# EAGLE schematic board (EAGLE 7.6.0)

## Sheet 1 of 2
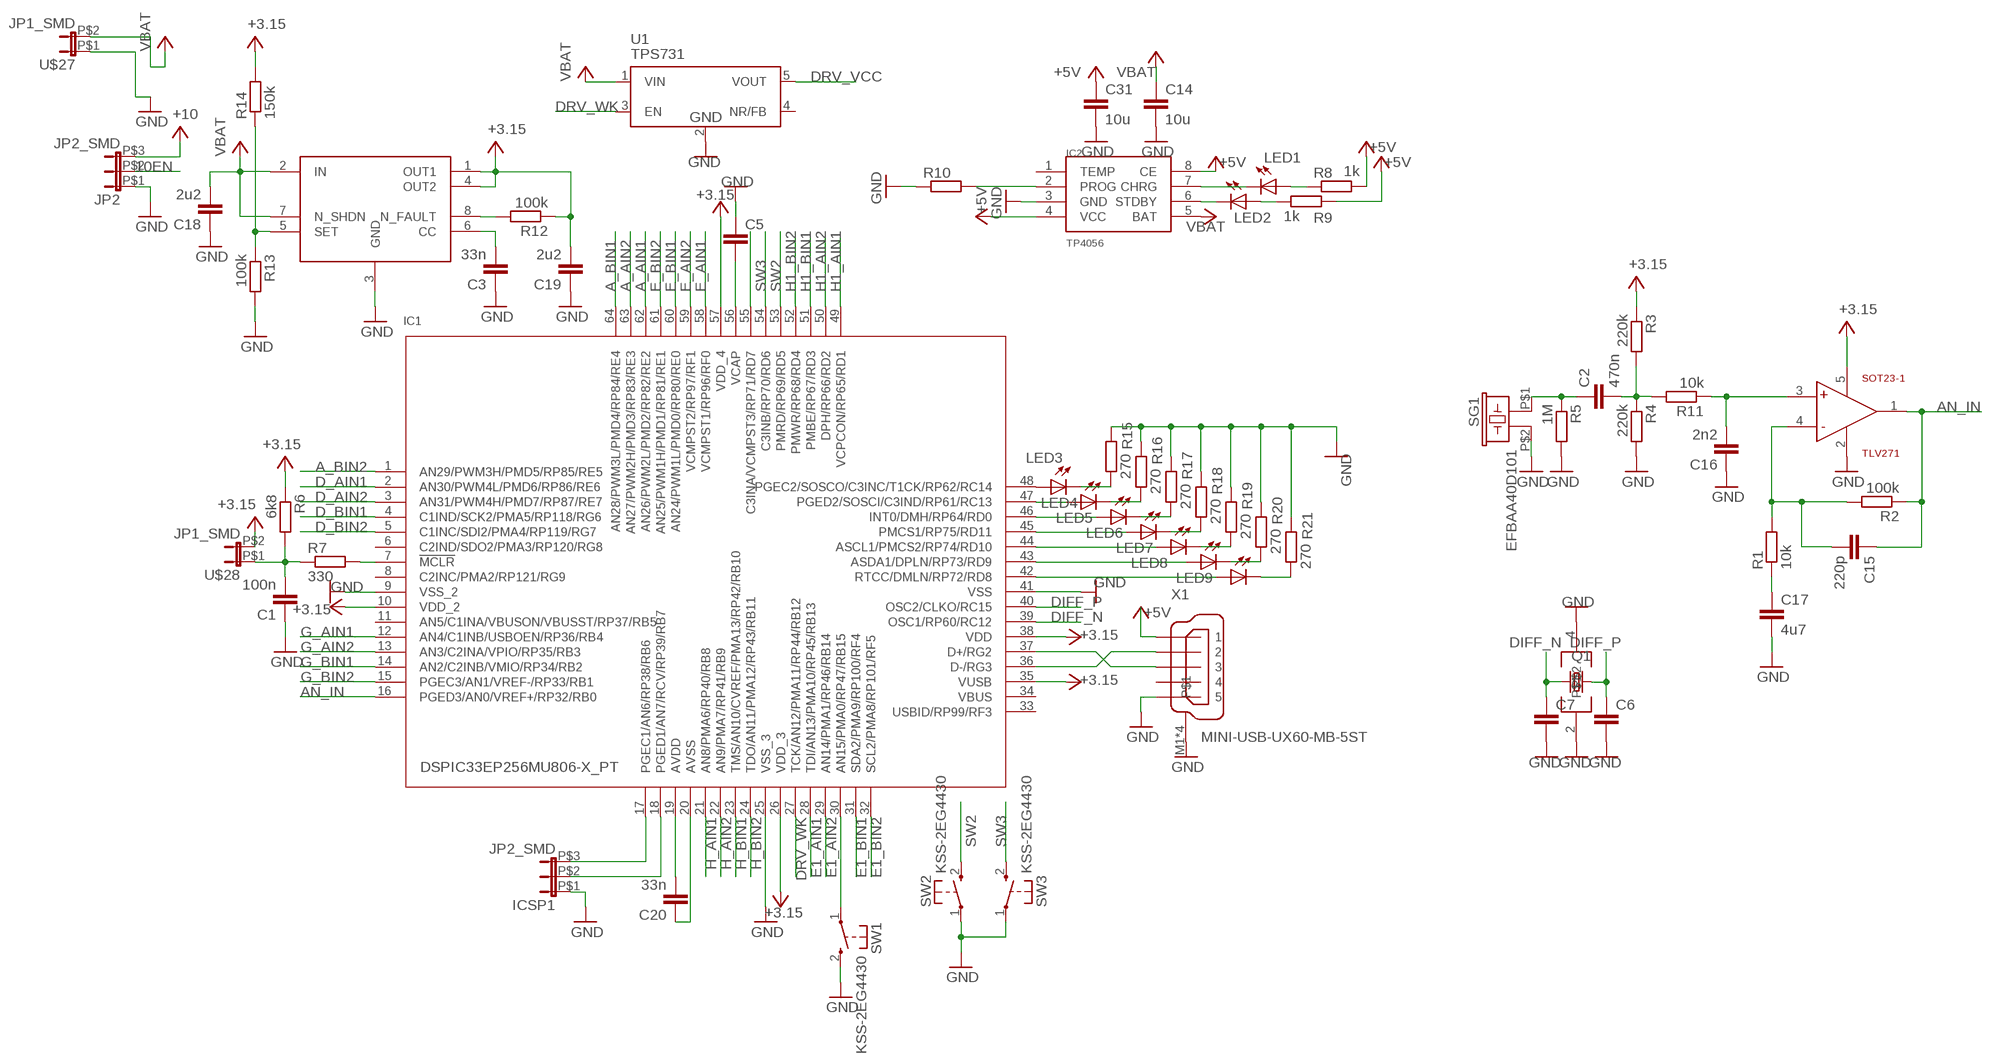
[diagram p0: schematic, sheet 1]

### Parts
C1  100n  CC0603  [C0603]
C2  470n  C  [C0805]
C3  33n  C  [C0805]
C5  CC1206  [C1206]
C6  C  [C0805]
C7  C  [C0805]
C14  10u  CC1206  [C1206]
C15  220p  C  [C0805]
C16  2n2  C  [C0805]
C17  4u7  CC1206  [C1206]
C18  2u2  C  [C0805]
C19  2u2  C  [C0805]
C20  33n  C  [C0805]
C31  10u  CC1206  [C1206]
IC1  DSPIC33EP256MU806-X_PT  [QFP64-10X10MC]
IC2  TP4056  [SOP-8]
ICSP1  JP2_SMD  [JP2_SMD]
JP2  JP2_SMD  [JP2_SMD]
LED1  LED_ESML0603  [LED_SML0603]
LED2  LED_ESML0603  [LED_SML0603]
LED3  LED_ESML0603  [LED_SML0603]
LED4  LED_ESML0603  [LED_SML0603]
LED5  LED_ESML0603  [LED_SML0603]
LED6  LED_ESML0603  [LED_SML0603]
LED7  LED_ESML0603  [LED_SML0603]
LED8  LED_ESML0603  [LED_SML0603]
LED9  LED_ESML0603  [LED_SML0603]
Q1  CRYSTALCTS406  [CTS406]
R1  10k  R  [R0805]
R2  100k  R  [R0805]
R3  220k  R  [R0805]
R4  220k  R  [R0805]
R5  1M  R  [R0805]
R6  6k8  RR0603  [R0603]
R7  330  RR0603  [R0603]
R8  1k  R  [R0805]
R9  1k  R  [R0805]
R10  R  [R0805]
R11  10k  R  [R0805]
R12  100k  R  [R0805]
R13  100k  R  [R0805]
R14  150k  R  [R0805]
R15  270  R  [R0805]
R16  270  R  [R0805]
R17  270  R  [R0805]
R18  270  R  [R0805]
R19  270  R  [R0805]
R20  270  R  [R0805]
R21  270  R  [R0805]
SG1  EFBAA40D101  [EFBAA40D101]
SOT23-1  TLV271  [SOT23-5]
SW1  KSS-2EG4430  [KSS-2EG4430]
SW2  KSS-2EG4430  [KSS-2EG4430]
SW3  KSS-2EG4430  [KSS-2EG4430]
U1  TPS731  [SOT25]
U$8  LP3982  [LP3982]
U$27  JP1_SMD  [JP1_SMD]
U$28  JP1_SMD  [JP1_SMD]
X1  MINI-USB-UX60-MB-5ST  [UX60-MB-5ST]

### Nets
10EN: IC1.55(C3INA/VCMPST3/RP71/RD7) JP2.P$2
+3.15: R6.1 U$28.P$2
+3.15V: C19.2 IC1.10(VDD_2) IC1.26(VDD_3) IC1.35(VUSB) IC1.38(VDD) IC1.57(VDD_4) R3.1 R12.1 R14.2 SOT23-1.5(VDD) U$8.1(OUT1) U$8.4(OUT2) ; supply symbol labelled +3.15 ; also sheet 2
+5V: C31.1 IC2.4(VCC) IC2.8(CE) R8.2 R9.2 X1.1
+10V: JP2.P$3 ; supply symbol labelled +10 ; also sheet 2
A_AIN1 [diffPair]: IC1.62(AN26/PWM2L/PMD2/RP82/RE2) ; also sheet 2
A_AIN2 [diffPair]: IC1.63(AN27/PWM2H/PMD3/RP83/RE3) ; also sheet 2
A_BIN1 [diffPair]: IC1.64(AN28/PWM3L/PMD4/RP84/RE4) ; also sheet 2
A_BIN2 [diffPair]: IC1.1(AN29/PWM3H/PMD5/RP85/RE5) ; also sheet 2
AN_IN: C15.1 IC1.16(PGED3/AN0/VREF+/RP32/RB0) R2.1 SOT23-1.1(OUT)
D_AIN1: IC1.2(AN30/PWM4L/PMD6/RP86/RE6) ; also sheet 2
D_AIN2: IC1.3(AN31/PWM4H/PMD7/RP87/RE7) ; also sheet 2
D_BIN1: IC1.4(C1IND/SCK2/PMA5/RP118/RG6) ; also sheet 2
D_BIN2: IC1.5(C1INC/SDI2/PMA4/RP119/RG7) ; also sheet 2
DIFF_N: C7.1 IC1.39(OSC1/RP60/RC12) Q1.3
DIFF_NS: IC1.36(D-/RG3) X1.2
DIFF_P: C6.1 IC1.40(OSC2/CLKO/RC15) Q1.1
DIFF_PD: IC1.37(D+/RG2) X1.3
DRV_VCC: U1.5(VOUT) ; also sheet 2
DRV_WK: IC1.27(TCK/AN12/PMA11/RP44/RB12) U1.3(EN)
E1_AIN1: IC1.28(TDI/AN13/PMA10/RP45/RB13) ; also sheet 2
E1_AIN2: IC1.29(AN14/PMA1/RP46/RB14) ; also sheet 2
E1_BIN1: IC1.31(SDA2/PMA9/RP100/RF4) ; also sheet 2
E1_BIN2: IC1.32(SCL2/PMA8/RP101/RF5) ; also sheet 2
E_AIN1: IC1.58(VCMPST1/RP96/RF0) ; also sheet 2
E_AIN2: IC1.59(VCMPST2/RP97/RF1) ; also sheet 2
E_BIN1: IC1.60(AN24/PWM1L/PMD0/RP80/RE0) ; also sheet 2
E_BIN2: IC1.61(AN25/PWM1H/PMD1/RP81/RE1) ; also sheet 2
FGH [diffPair]: IC1.17(PGEC1/AN6/RP38/RB6) ICSP1.P$3
G_AIN1: IC1.12(AN4/C1INB/USBOEN/RP36/RB4) ; also sheet 2
G_AIN2: IC1.13(AN3/C2INA/VPIO/RP35/RB3) ; also sheet 2
G_BIN1: IC1.14(AN2/C2INB/VMIO/RP34/RB2) ; also sheet 2
G_BIN2: IC1.15(PGEC3/AN1/VREF-/RP33/RB1) ; also sheet 2
GFD [diffPair]: IC1.18(PGED1/AN7/RCV/RP39/RB7) ICSP1.P$2
GND: C1.1 C3.1 C5.1 C6.2 C7.2 C14.2 C16.1 C17.2 C18.1 C19.1 C31.2 IC1.9(VSS_2) IC1.25(VSS_3) IC1.41(VSS) IC2.3(GND) ICSP1.P$1 JP2.P$1 Q1.2 Q1.4 R4.2 R5.2 R10.1 R13.2 R15.2 R16.2 R17.2 R18.2 R19.2 R20.2 R21.2 SG1.P$2 SOT23-1.2(GND) SW1.2(S) SW2.1(P) SW3.1(P) U1.2(GND) U$8.3(GND) U$27.P$1 X1.5 X1.M1 X1.M2 X1.M3 X1.M4 ; also sheet 2
H1_AIN1: IC1.49(VCPCON/RP65/RD1) ; also sheet 2
H1_AIN2: IC1.50(DPH/RP66/RD2) ; also sheet 2
H1_BIN1: IC1.51(PMBE/RP67/RD3) ; also sheet 2
H1_BIN2: IC1.52(PMWR/RP68/RD4) ; also sheet 2
H_AIN1: IC1.21(AN8/PMA6/RP40/RB8) ; also sheet 2
H_AIN2: IC1.22(AN9/PMA7/RP41/RB9) ; also sheet 2
H_BIN1: IC1.23(TMS/AN10/CVREF/PMA13/RP42/RB10) ; also sheet 2
H_BIN2: IC1.24(TDO/AN11/PMA12/RP43/RB11) ; also sheet 2
N$3: C20.2 IC1.19(AVDD)
N$4: C20.1 IC1.20(AVSS)
N$5: IC1.7(!MCLR) R7.2
N$6: C5.2 IC1.56(VCAP)
N$11: IC1.48(PGEC2/SOSCO/C3INC/T1CK/RP62/RC14) LED3.A
N$12: C15.2 R1.2 R2.2 SOT23-1.4(IN-)
N$13: C17.1 R1.1
N$14: C2.2 R3.2 R4.1 R11.2
N$15: IC2.7(CHRG) LED1.C
N$16: C2.1 R5.1 SG1.P$1
N$21: IC2.6(STDBY) LED2.C
N$22: LED2.A R9.1
N$23: LED1.A R8.1
N$24: IC2.2(PROG) R10.2
N$25: C16.2 R11.1 SOT23-1.3(IN+)
N$26: R12.2 U$8.8(N_FAULT)
N$31: C3.2 U$8.6(CC)
N$32: IC1.47(PGED2/SOSCI/C3IND/RP61/RC13) LED4.A
N$33: R13.1 R14.1 U$8.5(SET)
N$34: IC1.46(INT0/DMH/RP64/RD0) LED5.A
N$42: IC1.45(PMCS1/RP75/RD11) LED6.A
N$43: IC1.44(ASCL1/PMCS2/RP74/RD10) LED7.A
N$44: IC1.43(ASDA1/DPLN/RP73/RD9) LED8.A
N$45: IC1.42(RTCC/DMLN/RP72/RD8) LED9.A
N$46: LED9.C R21.1
N$51: LED8.C R20.1
N$52: LED7.C R19.1
N$53: LED6.C R18.1
N$54: LED5.C R17.1
N$55: LED4.C R16.1
N$56: LED3.C R15.1
N$62: IC1.30(AN15/PMA0/RP47/RB15) SW1.1(P)
RST: C1.2 R6.2 R7.1 U$28.P$1
SW2: IC1.53(PMRD/RP69/RD5) SW2.2(S)
SW3: IC1.54(C3INB/RP70/RD6) SW3.2(S)
VBAT: C14.1 C18.2 IC2.5(BAT) U1.1(VIN) U$8.2(IN) U$8.7(N_SHDN) U$27.P$2 ; also sheet 2
Unconnected: IC1.6(C2IND/SDO2/PMA3/RP120/RG8) IC1.8(C2INC/PMA2/RP121/RG9) IC1.11(AN5/C1INA/VBUSON/VBUSST/RP37/RB5) IC1.33(USBID/RP99/RF3) IC2.1(TEMP) U1.4(NR/FB) X1.4

## Sheet 2 of 2
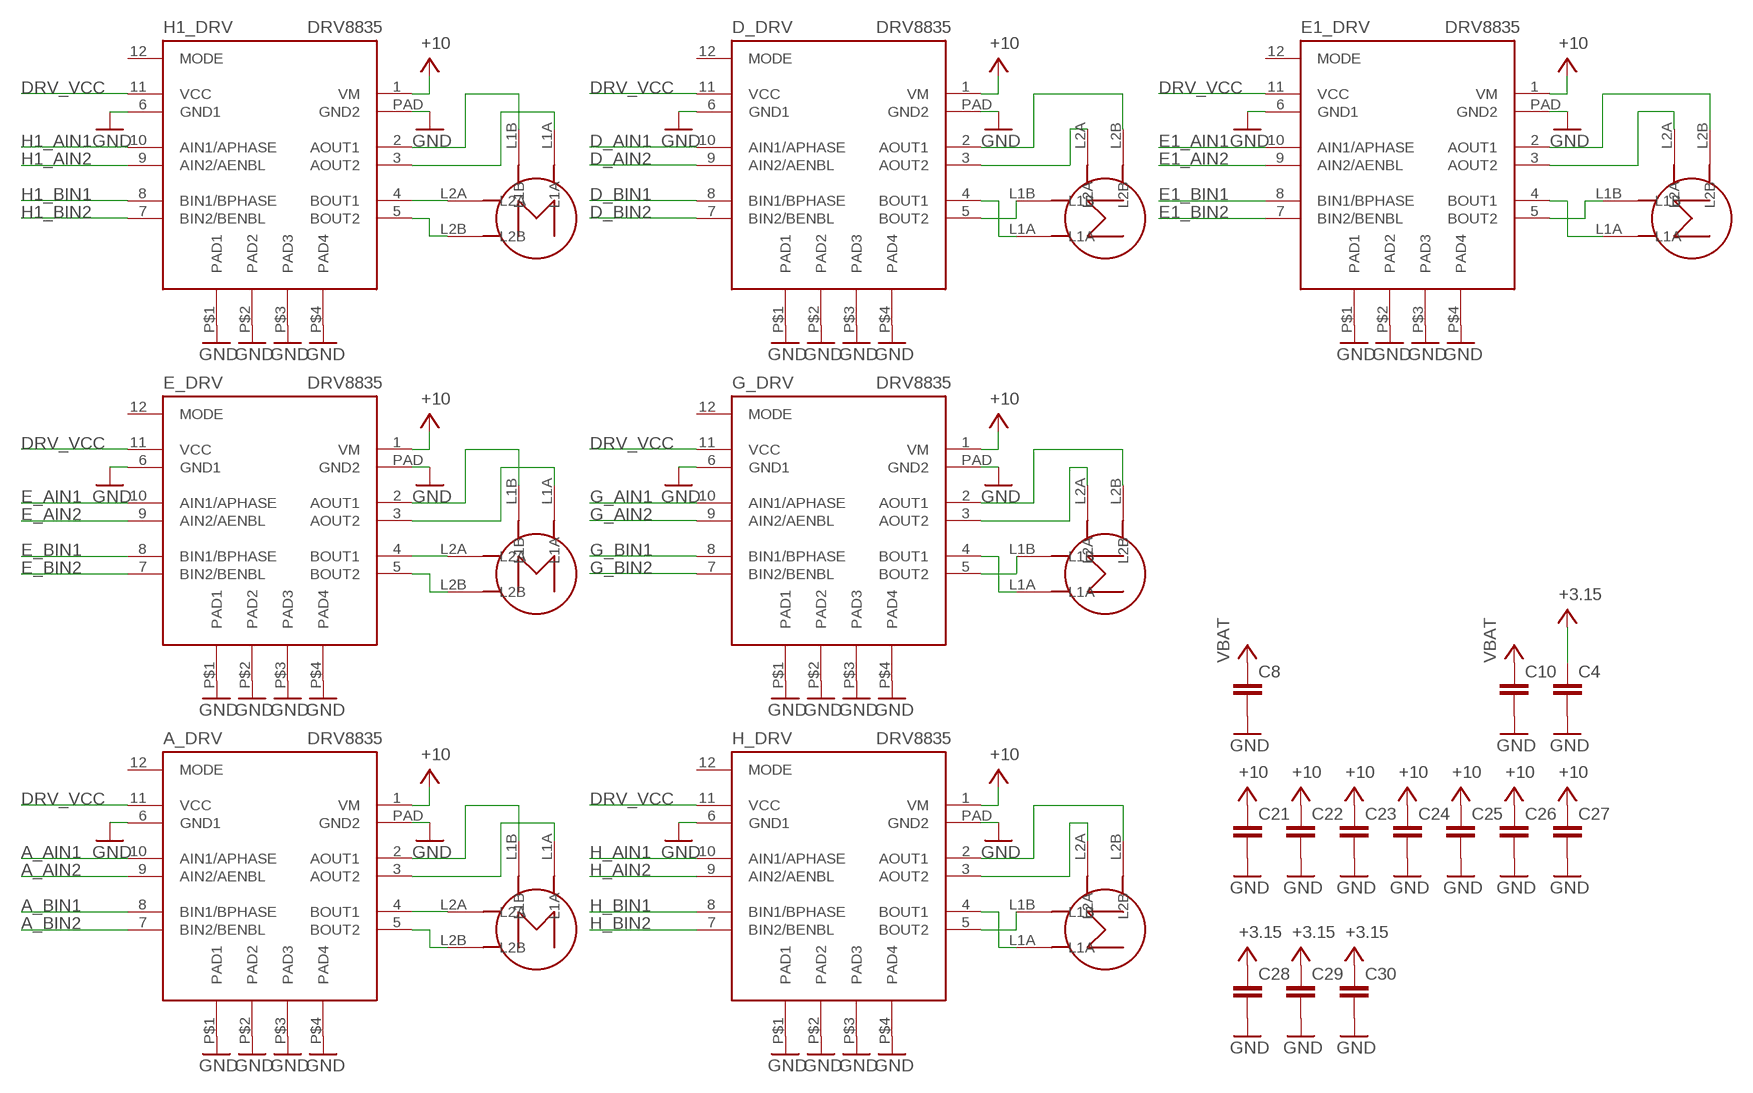
[diagram p1: schematic, sheet 2]

### Parts
A_DRV  DRV8835  [WSON_2X3]
C4  CC1206  [C1206]
C8  CC1206  [C1206]
C10  CC1206  [C1206]
C21  CC1206  [C1206]
C22  CC1206  [C1206]
C23  CC1206  [C1206]
C24  CC1206  [C1206]
C25  CC1206  [C1206]
C26  CC1206  [C1206]
C27  CC1206  [C1206]
C28  CC1206  [C1206]
C29  CC1206  [C1206]
C30  CC1206  [C1206]
D_DRV  DRV8835  [WSON_2X3]
E1_DRV  DRV8835  [WSON_2X3]
E_DRV  DRV8835  [WSON_2X3]
G_DRV  DRV8835  [WSON_2X3]
H1_DRV  DRV8835  [WSON_2X3]
H1šWF  H1  STEP_MOTOR  [STEP_MOTOR]
H_DRV  DRV8835  [WSON_2X3]
U$1  STEP_MOTOR_MIRROR  [STEP_MOTOR_MIRROR]
U$2  STEP_MOTOR_MIRROR  [STEP_MOTOR_MIRROR]
U$3  STEP_MOTOR_MIRROR  [STEP_MOTOR_MIRROR]
U$4  STEP_MOTOR  [STEP_MOTOR]
U$6  STEP_MOTOR  [STEP_MOTOR]
U$7  STEP_MOTOR_MIRROR  [STEP_MOTOR_MIRROR]

### Nets
+3.15V: C4.1 C28.1 C29.1 C30.1 ; supply symbol labelled +3.15 ; also sheet 1
+10V: A_DRV.1(VM) C21.1 C22.1 C23.1 C24.1 C25.1 C26.1 C27.1 D_DRV.1(VM) E1_DRV.1(VM) E_DRV.1(VM) G_DRV.1(VM) H1_DRV.1(VM) H_DRV.1(VM) ; supply symbol labelled +10 ; also sheet 1
A_AIN1 [diffPair]: A_DRV.10(AIN1/APHASE) ; also sheet 1
A_AIN2 [diffPair]: A_DRV.9(AIN2/AENBL) ; also sheet 1
A_BIN1 [diffPair]: A_DRV.8(BIN1/BPHASE) ; also sheet 1
A_BIN2 [diffPair]: A_DRV.7(BIN2/BENBL) ; also sheet 1
D_AIN1: D_DRV.10(AIN1/APHASE) ; also sheet 1
D_AIN2: D_DRV.9(AIN2/AENBL) ; also sheet 1
D_BIN1: D_DRV.8(BIN1/BPHASE) ; also sheet 1
D_BIN2: D_DRV.7(BIN2/BENBL) ; also sheet 1
DRV_VCC: A_DRV.11(VCC) D_DRV.11(VCC) E1_DRV.11(VCC) E_DRV.11(VCC) G_DRV.11(VCC) H1_DRV.11(VCC) H_DRV.11(VCC) ; also sheet 1
E1_AIN1: E1_DRV.10(AIN1/APHASE) ; also sheet 1
E1_AIN2: E1_DRV.9(AIN2/AENBL) ; also sheet 1
E1_BIN1: E1_DRV.8(BIN1/BPHASE) ; also sheet 1
E1_BIN2: E1_DRV.7(BIN2/BENBL) ; also sheet 1
E_AIN1: E_DRV.10(AIN1/APHASE) ; also sheet 1
E_AIN2: E_DRV.9(AIN2/AENBL) ; also sheet 1
E_BIN1: E_DRV.8(BIN1/BPHASE) ; also sheet 1
E_BIN2: E_DRV.7(BIN2/BENBL) ; also sheet 1
G_AIN1: G_DRV.10(AIN1/APHASE) ; also sheet 1
G_AIN2: G_DRV.9(AIN2/AENBL) ; also sheet 1
G_BIN1: G_DRV.8(BIN1/BPHASE) ; also sheet 1
G_BIN2: G_DRV.7(BIN2/BENBL) ; also sheet 1
GND: A_DRV.6(GND1) A_DRV.P$1(PAD1) A_DRV.P$2(PAD2) A_DRV.P$3(PAD3) A_DRV.P$4(PAD4) A_DRV.PAD(GND2) C4.2 C8.2 C10.2 C21.2 C22.2 C23.2 C24.2 C25.2 C26.2 C27.2 C28.2 C29.2 C30.2 D_DRV.6(GND1) D_DRV.P$1(PAD1) D_DRV.P$2(PAD2) D_DRV.P$3(PAD3) D_DRV.P$4(PAD4) D_DRV.PAD(GND2) E1_DRV.6(GND1) E1_DRV.P$1(PAD1) E1_DRV.P$2(PAD2) E1_DRV.P$3(PAD3) E1_DRV.P$4(PAD4) E1_DRV.PAD(GND2) E_DRV.6(GND1) E_DRV.P$1(PAD1) E_DRV.P$2(PAD2) E_DRV.P$3(PAD3) E_DRV.P$4(PAD4) E_DRV.PAD(GND2) G_DRV.6(GND1) G_DRV.P$1(PAD1) G_DRV.P$2(PAD2) G_DRV.P$3(PAD3) G_DRV.P$4(PAD4) G_DRV.PAD(GND2) H1_DRV.6(GND1) H1_DRV.P$1(PAD1) H1_DRV.P$2(PAD2) H1_DRV.P$3(PAD3) H1_DRV.P$4(PAD4) H1_DRV.PAD(GND2) H_DRV.6(GND1) H_DRV.P$1(PAD1) H_DRV.P$2(PAD2) H_DRV.P$3(PAD3) H_DRV.P$4(PAD4) H_DRV.PAD(GND2) ; also sheet 1
H1_AIN1: H1_DRV.10(AIN1/APHASE) ; also sheet 1
H1_AIN2: H1_DRV.9(AIN2/AENBL) ; also sheet 1
H1_BIN1: H1_DRV.8(BIN1/BPHASE) ; also sheet 1
H1_BIN2: H1_DRV.7(BIN2/BENBL) ; also sheet 1
H_AIN1: H_DRV.10(AIN1/APHASE) ; also sheet 1
H_AIN2: H_DRV.9(AIN2/AENBL) ; also sheet 1
H_BIN1: H_DRV.8(BIN1/BPHASE) ; also sheet 1
H_BIN2: H_DRV.7(BIN2/BENBL) ; also sheet 1
N$7: D_DRV.2(AOUT1) U$2.L2B
N$8: D_DRV.3(AOUT2) U$2.L2A
N$9: D_DRV.5(BOUT2) U$2.L1B
N$10: D_DRV.4(BOUT1) U$2.L1A
N$17: E1_DRV.2(AOUT1) U$1.L2B
N$18: E1_DRV.3(AOUT2) U$1.L2A
N$19: E1_DRV.4(BOUT1) U$1.L1A
N$20: E1_DRV.5(BOUT2) U$1.L1B
N$27: G_DRV.2(AOUT1) U$3.L2B
N$28: G_DRV.3(AOUT2) U$3.L2A
N$29: G_DRV.5(BOUT2) U$3.L1B
N$30: G_DRV.4(BOUT1) U$3.L1A
N$35: E_DRV.5(BOUT2) U$4.L2B
N$36: H_DRV.4(BOUT1) U$7.L1A
N$37: E_DRV.2(AOUT1) U$4.L1B
N$38: E_DRV.3(AOUT2) U$4.L1A
N$40: E_DRV.4(BOUT1) U$4.L2A
N$41: A_DRV.5(BOUT2) U$6.L2B
N$47: H1_DRV.2(AOUT1) H1šWF.L1B
N$48: H1_DRV.3(AOUT2) H1šWF.L1A
N$49: H1_DRV.5(BOUT2) H1šWF.L2B
N$50: H1_DRV.4(BOUT1) H1šWF.L2A
N$57: A_DRV.2(AOUT1) U$6.L1B
N$58: A_DRV.3(AOUT2) U$6.L1A
N$60: A_DRV.4(BOUT1) U$6.L2A
N$67: H_DRV.2(AOUT1) U$7.L2B
N$68: H_DRV.3(AOUT2) U$7.L2A
N$69: H_DRV.5(BOUT2) U$7.L1B
VBAT: C8.1 C10.1 ; also sheet 1
Unconnected: A_DRV.12(MODE) D_DRV.12(MODE) E1_DRV.12(MODE) E_DRV.12(MODE) G_DRV.12(MODE) H1_DRV.12(MODE) H_DRV.12(MODE)

## Power pins joined to a net without a drawn wire
VBUS: IC1.34(VBUS)

## Library data of the parts
A_DRV D_DRV E1_DRV E_DRV G_DRV H1_DRV H_DRV = bt_motordriver:DRV8835: DRV8835 DUAL LOW VOLTAGE H-BRIDGE IC The DRV8835 provides an integrated motor driver solution for cameras, consumer products, toys, and other low voltage or battery-powered motion control applications. The device has two H-bridge drivers, and can drive two DC motors or one stepper motor, as well as other devices like solenoids. The device has two H-bridge drivers, and drives two DC motors or one stepper motor, as well as other devices like solenoids. The output driver block for each consists of N-channel power MOSFETs configured as an H-bridge to drive the motor winding. An internal charge pump generates gate drive voltages. 1.5-A Maximum Drive Current Per H-Bridge Configure Bridges Parallel for 3-A Drive Curren 0-V to 11-V Motor-Operating Supply-Voltage 2-V to 7-V Logic Supply-Voltage Flexible PWM or PHASE/ENABLE Interface Low-Power Sleep Mode With 95-nA Maximum Supply Current Tiny 2.00-mm × 3.00-mm WSON Package Reference: http://www.ti.com/lit/ds/symlink/drv8835.pdf
C1-C8 C10 C14-C31 = eagle-ltspice:C: CAPACITOR, European symbol; SPICEMODEL: NONE; SPICEPREFIX: C
H1šWF U$4 U$6 = diplomka:STEP_MOTOR
IC1 = dspic33ep:DSPIC33EP256MU806-X_PT: dsPIC33EP256MU806-X_PT QFP64 10x10
IC2 = TP4056.lbr:TP4056
ICSP1 JP2 = jumper:JP2_SMD
LED1-LED9 = eagle-ltspice:LED_E: LED Source: http://www.osram.convergy.de Source: www.luxeon.com Source: www.kingbright.com; SPICEMODEL: NONE; SPICEPREFIX: D; SPICETYPE: diode
Q1 = crystal:CRYSTAL: CRYSTAL; OC_FARNELL: unknown; OC_NEWARK: unknown
R1-R21 = eagle-ltspice:R: RESISTOR, European symbol; SPICEMODEL: NONE; SPICEPREFIX: R
SG1 = buzzer:EFB?: Piezoelectric Acoustic Transducer Source: Panbasonic .. 2SC1685.pdf; OC_FARNELL: unknown; OC_NEWARK: unknown
SOT23-1 = texas_instruments:TLV271: TLV271 Single channel 3mhz Op-Amp
SW1-SW3 = buttons:KSS-2EG4430: Size: 3x6mm Height: 5mm from PCB Rating: DC12v 50mA Travel: 0.25±0.10mm Operating Force: 180±50gf Return Force: 60gf min Contact resistance: 100m? max Insulation resistance: 100M? min Operating life?50,000 cycles
U1 = TPS731xx:TPS731*
U$1-U$3 U$7 = diplomka:STEP_MOTOR_MIRROR
U$8 = diplomka2:LP3982
U$27 U$28 = jumper:JP1_SMD
X1 = con-hirose:MINI-USB-: MINI USB Connector Source: http://www.hirose.co.jp/cataloge_hp/e24000019.pdf; OC_FARNELL: unknown; OC_NEWARK: unknown

## Net classes
0 default: width 0.15 mm, drill 0.3 mm, clearance 0.15 mm
1 diffPair: width 0.15 mm, drill 0.3 mm, clearance 0.15 mm